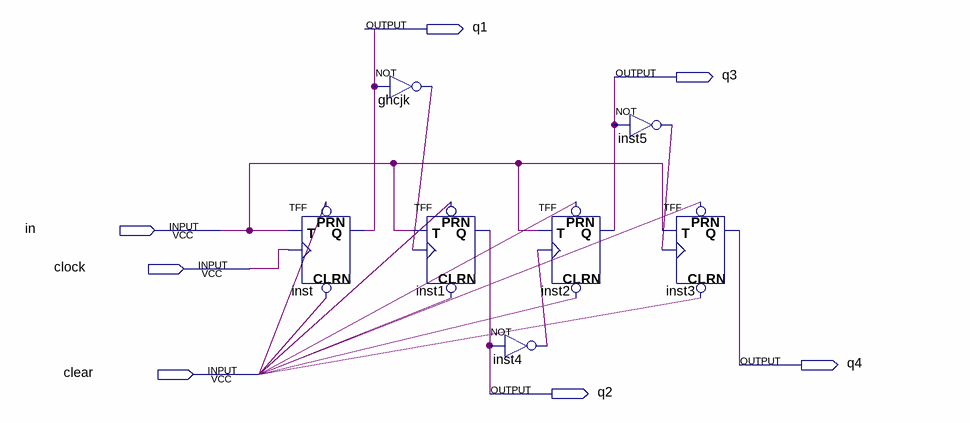
[diagram p0: schematic sheet]
// Quartus schematic question3a.bdf as structural Verilog: 7 symbols, 7 pins
module question3a (
  input  in,
  input  clock,
  input  clear,
  output q1,
  output q3,
  output q4,
  output q2
);

  wire ghcjk_out, inst4_out, inst5_out;

  TFF inst (.PRN(clear), .CLRN(clear), .T(in), .CLK(clock), .Q(q1));
  not ghcjk (ghcjk_out, q1);
  TFF inst1 (.PRN(clear), .CLRN(clear), .T(in), .CLK(ghcjk_out), .Q(q2));
  not inst4 (inst4_out, q2);
  TFF inst2 (.PRN(clear), .CLRN(clear), .T(in), .CLK(inst4_out), .Q(q3));
  not inst5 (inst5_out, q3);
  TFF inst3 (.PRN(clear), .CLRN(clear), .T(in), .CLK(inst5_out), .Q(q4));
endmodule
